# Altium schematic sheet AUDIO.SchDoc: AUDIO
size A4; Date: Not used; ApprovedBy: Not used; CheckedBy: Not used; Author: Not used; CompanyName: STMicroelectronics; DrawnBy: Not used; Engineer: Not used; Organization: Not used; Address1: Not used; Address2: Not used; Address3: Not used; Address4: Not used; DocumentNumber: Not used; Revision: Not used; SheetNumber: 15; SheetTotal: 18; CurrentTime: Not used; CurrentDate: Not used; Time: Not used; DocumentFullPathAndName: Not used; DocumentName: Not used; ModifiedDate: Not used; ImagePath: Not used; ProjectName: Not used; Application_BuildNumber: Not used
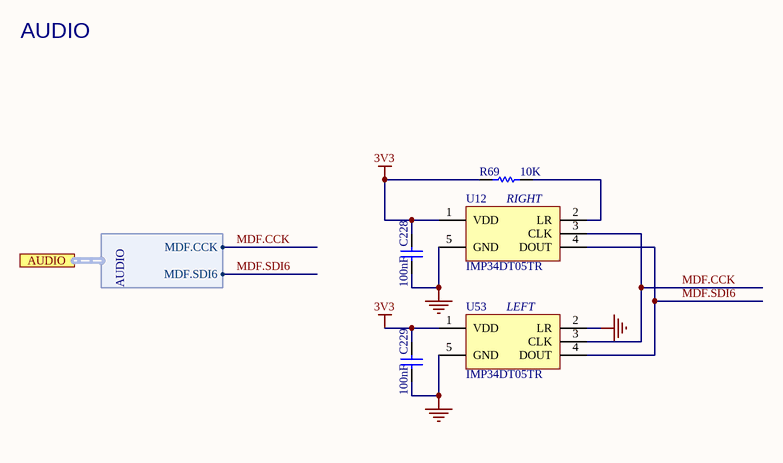
[diagram p0: AUDIO.SchDoc]

## Parts
C228  value 100nF  [C0402]
C229  value 100nF  [C0402]
R69  value 10K  [R0402]  (hidden comment: Resistor)
U12  IMP34DT05TR  [MIC_HCLGA_3X4X1_4LD]
U53  IMP34DT05TR  [MIC_HCLGA_3X4X1_4LD]

## Ports
AUDIO (harness AUDIO)

## Harnesses
AUDIO: MDF.CCK, MDF.SDI6

## Nets
3V3: C228.1 C229.1 R69.1 U12.1(VDD) U53.1(VDD)
GND: C228.2 C229.2 U12.5(GND) U53.2(LR) U53.5(GND)
MDF.CCK: U12.3(CLK) U53.3(CLK) ; port AUDIO.MDF.CCK
MDF.SDI6: U12.4(DOUT) U53.4(DOUT) ; port AUDIO.MDF.SDI6
NetR69_2: R69.2 U12.2(LR)

## Notes on the sheet
- AUDIO
- RIGHT
- (near U53) LEFT
- Title:
- Project:
- Size:
- Revision:
- Variant:
- A4
- -
- Date:
- Reference:
- Sheet:
- of

## Library data of the parts
C228 C229 = MCD-00006: Capacitor,100nF,16V,X7R,10%,0402; Manufacturer_Part_Number: CC0402KRX7R7BB104; Manufacturer: YAGEO; Alternate_Manufacturer: MURATA; Alternate_Manufacturer_Part_Number: GCM155R71C104KA55D; Part_Preference: Recommended; Partial_Alternate_Internal_Part_Number: MCD-03299; Provided_By: SUBCO; Initial_Board_Reference: mb1274; Order_Code_RS: 616-9701; Alternate_EMS: M; Component_Country_Of_Origin: China; ID: 2474; ShowFields: YES; Internal_Part_Number: MCD-00006; ComponentLink1Description: Datasheet; ECCN_US: n/a; ECCN_EU: n/a; Status: Released; Part_Type: Capacitor; Package: 0402; ComponentLink1URL: http://tunmcdsvn.tun.st.com/Component_Documentation_Library/Trunk/Capacitor/YAGEO_X7R_Series; Order_Code_Digikey: 311-1338-1-ND; Order_Code_Farnell: 9402047
R69 = MCD-00053: Resistor,10K,0402,1%,1/16W; BMS_Part_Number: 9131590; Part_Preference: Recommended; Manufacturer: YAGEO; Manufacturer_Part_Number: RC0402FR-0710KL; Component_Country_Of_Origin: China; ID: 2539; ShowFields: YES; Internal_Part_Number: MCD-00053; Status: Released; Part_Type: Resistor; Package: 0402; ComponentLink1Description: Datasheet; ComponentLink1URL: http://tunmcdsvn.tun.st.com/Component_Documentation_Library/Trunk/Resistor/YAGEO_RC_L_Series; Order_Code_Digikey: 311-10.0KLRCT-ND; Order_Code_Farnell: 9239359; Order_Code_RS: N/A
U12 U53 = MCD-01715: MEMS audio sensor omnidirectional digital microphone for industrial applications; BMS_Part_Number: 9177995; Part_Preference: Recommended; Part_Type: IC; Manufacturer: STMICROELECTRONICS; Manufacturer_HQ_COO: EU; Component_Country_Of_Origin: Philippines; ID: 3815; ShowFields: YES; Internal_Part_Number: MCD-01715; Value: IMP34DT05TR; Status: Released; Manufacturer_Part_Number: IMP34DT05TR; Package: HCLGA-4LD; ComponentLink1Description: Datasheet; ComponentLink1URL: http://tunmcdsvn.tun.st.com/Component_Documentation_Library/Trunk/IC/STMICROELECTRONICS_IMP34DT05TR; Order_Code_Digikey: N/A; Order_Code_Farnell: N/A; Order_Code_RS: N/A